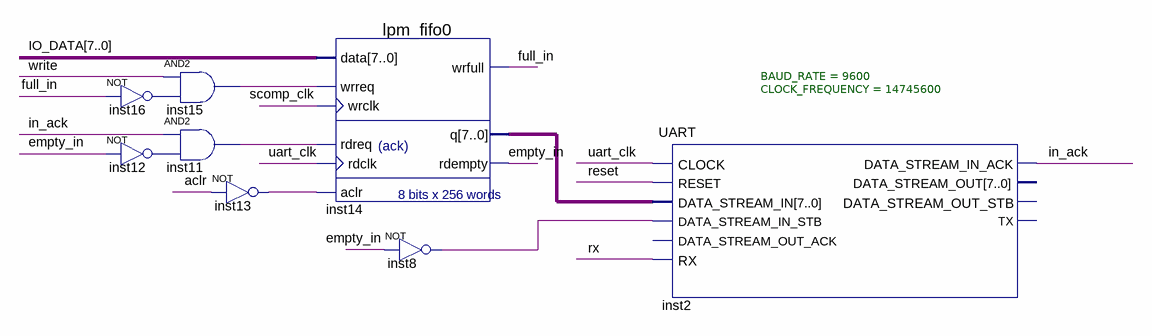
[diagram p0: schematic sheet]
// Quartus schematic UART_INTERFACE_IN.bdf as structural Verilog: 8 symbols, 0 pins
module UART_INTERFACE_IN (
);

  wire aclr, empty_in, full_in, in_ack, inst8_out, inst11_out, inst12_out, inst13_out, inst15_out,
       inst16_out, reset, rx, scomp_clk, uart_clk, write;
  wire [7:0] inst14_q, IO_DATA;

  and inst15 (inst15_out, write, inst16_out);
  not inst16 (inst16_out, full_in);
  and inst11 (inst11_out, in_ack, inst12_out);
  not inst12 (inst12_out, empty_in);
  not inst13 (inst13_out, aclr);
  lpm_fifo0 inst14 (
    .data(IO_DATA), .wrreq(inst15_out), .wrclk(scomp_clk), .rdreq(inst11_out), .rdclk(uart_clk),
    .aclr(inst13_out), .wrfull(full_in), .q(inst14_q), .rdempty(empty_in));
  not inst8 (inst8_out, empty_in);
  UART #(.BAUD_RATE(9600), .CLOCK_FREQUENCY(14745600)) inst2 (
    .CLOCK(uart_clk), .RESET(reset), .DATA_STREAM_IN(inst14_q), .DATA_STREAM_IN_STB(inst8_out), .RX(rx),
    .DATA_STREAM_IN_ACK(in_ack));  // open: DATA_STREAM_OUT_ACK, DATA_STREAM_OUT, DATA_STREAM_OUT_STB, TX
endmodule
